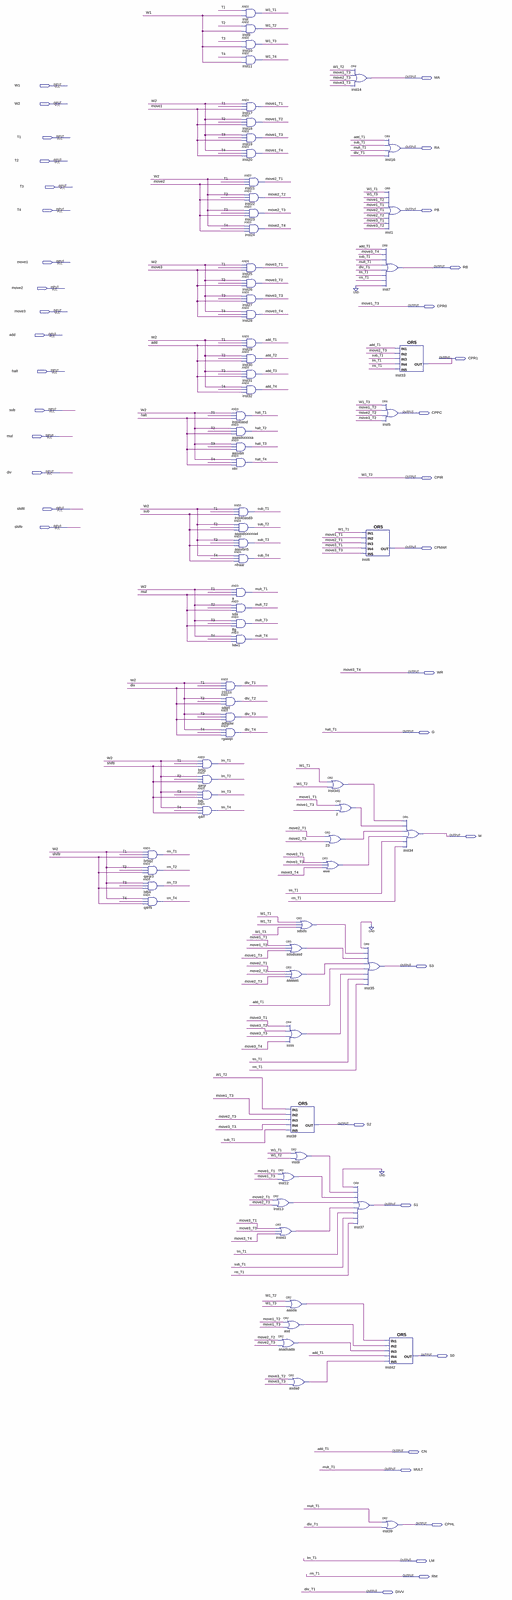
[diagram p0: schematic sheet, whole]
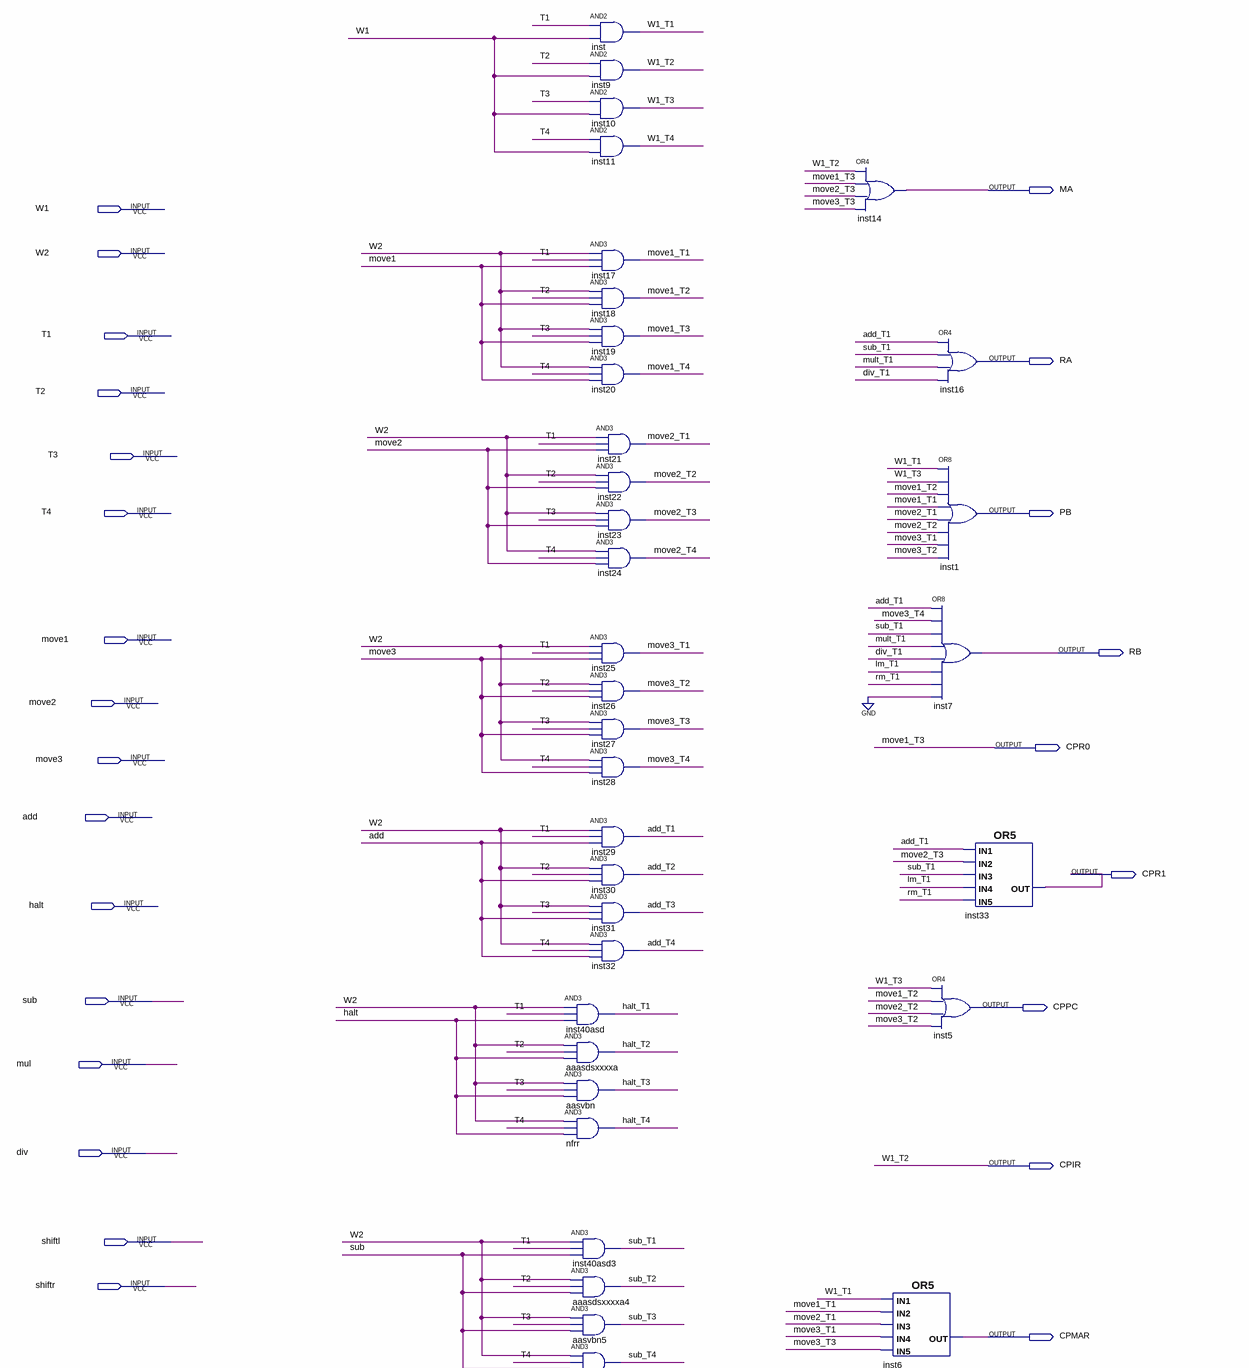
[diagram p1: schematic sheet, upper part]
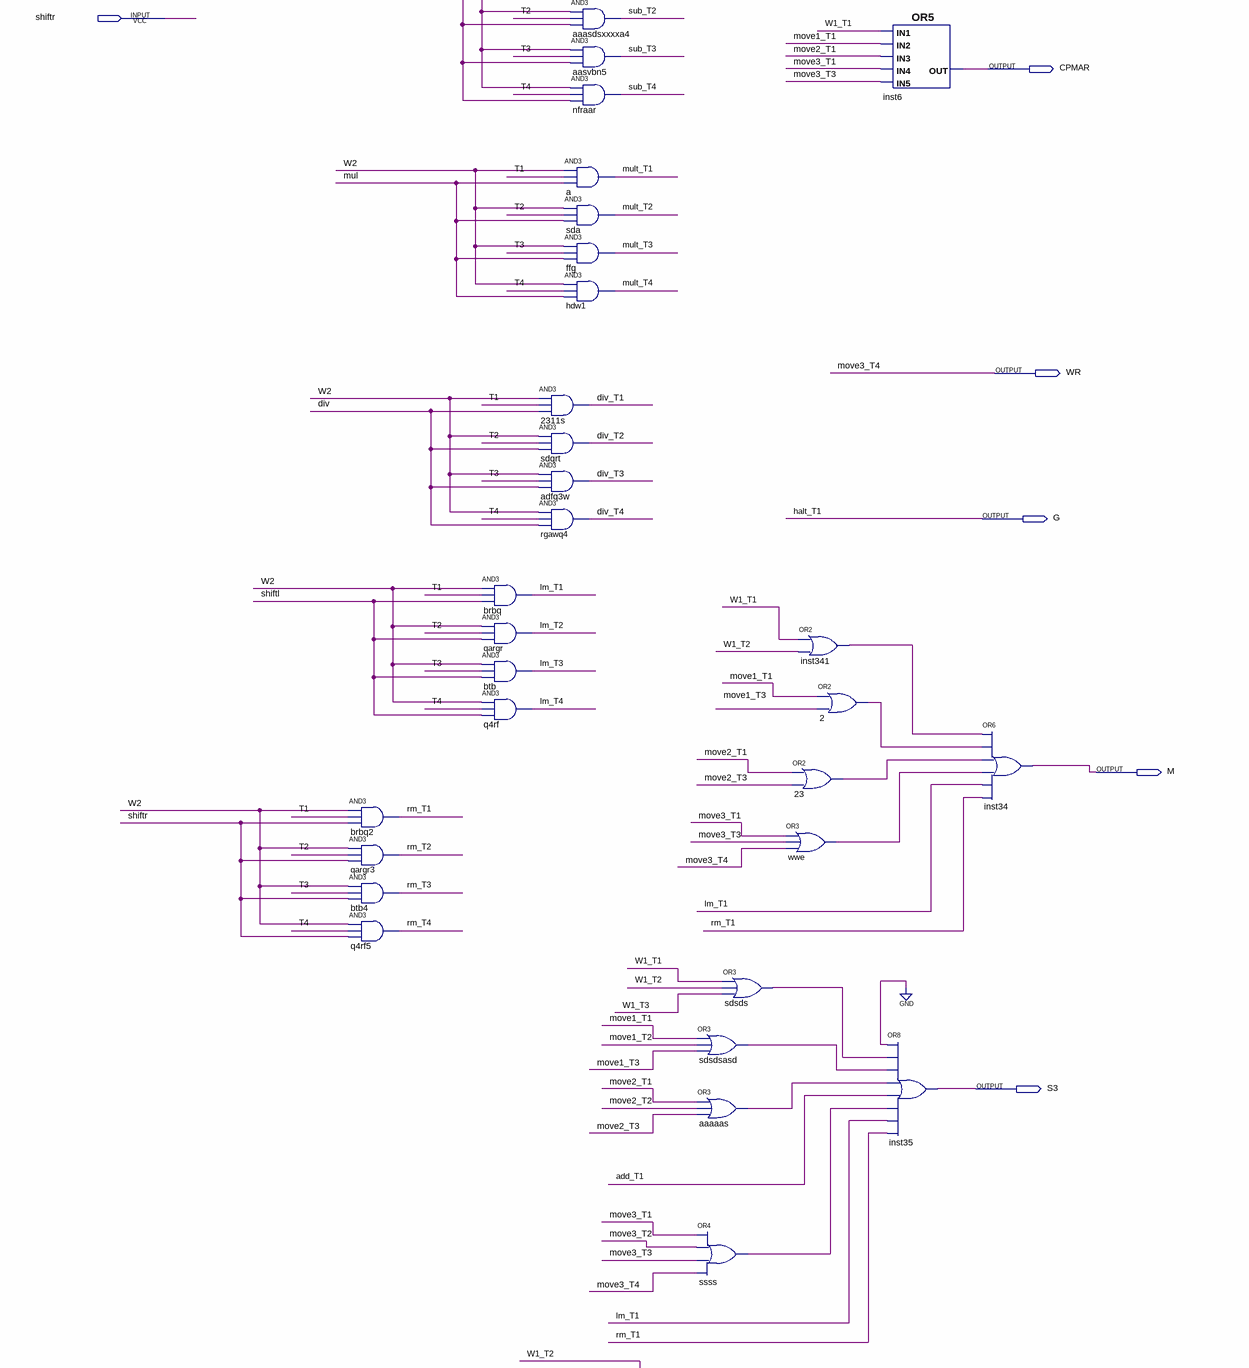
[diagram p2: schematic sheet, middle part]
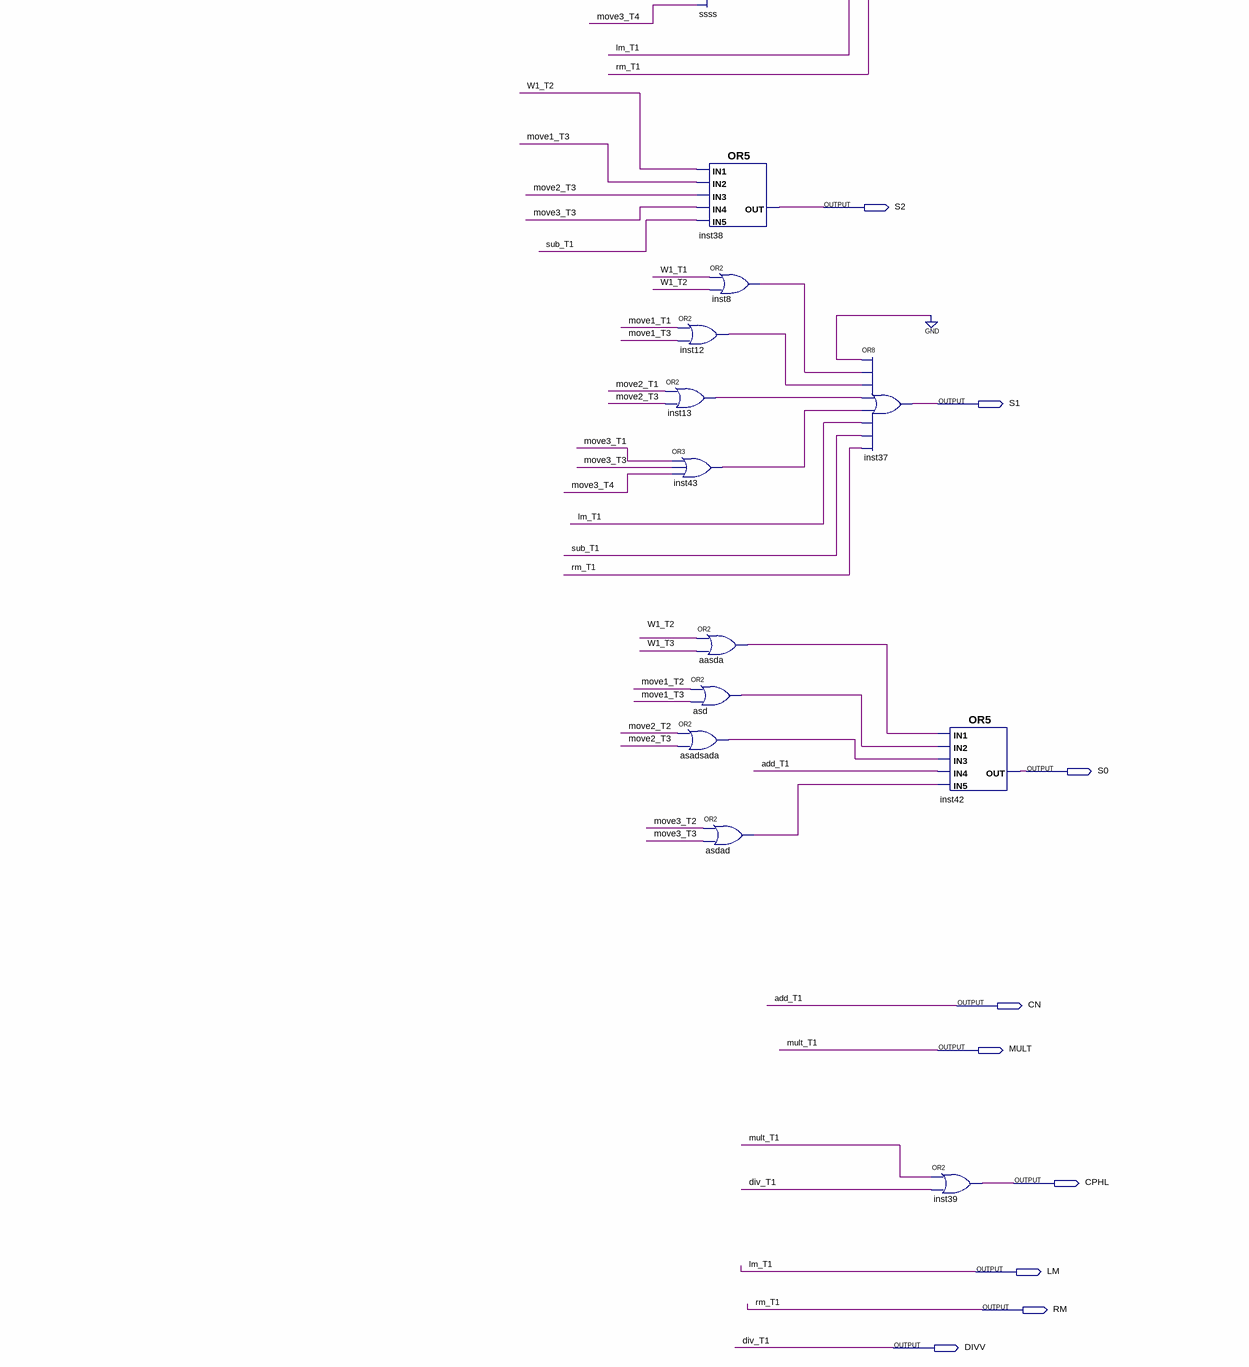
[diagram p3: schematic sheet, lower part]
// Quartus schematic Decoder.bdf as structural Verilog: 73 symbols, 38 pins
module Decoder (
  input  W1,
  input  W2,
  input  T1,
  input  T2,
  input  T3,
  input  T4,
  input  move1,
  input  move2,
  input  move3,
  input  add,
  input  halt,
  input  sub,
  input  mul,
  input  div,
  input  shiftl,
  input  shiftr,
  output MA,
  output RA,
  output PB,
  output RB,
  output CPR0,
  output CPR1,
  output CPPC,
  output CPIR,
  output CPMAR,
  output WR,
  output G,
  output M,
  output S3,
  output S2,
  output S1,
  output S0,
  output CN,
  output MULT,
  output CPHL,
  output LM,
  output RM,
  output DIVV
);

  wire aaaaas_out, aasda_out, add_T2, add_T3, add_T4, asadsada_out, asd_out, asdad_out, div_T2, div_T3,
       div_T4, halt_T2, halt_T3, halt_T4, inst8_out, inst12_out, inst13_out, inst43_out, inst341_out, lm_T2,
       lm_T3, lm_T4, move1_T1, move1_T2, move1_T4, move2_T1, move2_T2, move2_T3, move2_T4, move3_T1,
       move3_T2, move3_T3, mult_T2, mult_T3, mult_T4, n2_out, n23_out, rm_T2, rm_T3, rm_T4, sdsds_out,
       sdsdsasd_out, ssss_out, sub_T1, sub_T2, sub_T3, sub_T4, W1_T1, W1_T3, W1_T4, wwe_out;

  and brbq2 (RM, W2, T1, shiftr);
  and qargr3 (rm_T2, W2, T2, shiftr);
  and btb4 (rm_T3, W2, T3, shiftr);
  and q4rf5 (rm_T4, W2, T4, shiftr);
  and brbq (LM, W2, T1, shiftl);
  and qargr (lm_T2, W2, T2, shiftl);
  and btb (lm_T3, W2, T3, shiftl);
  and q4rf (lm_T4, W2, T4, shiftl);
  and u_2311s (DIVV, W2, T1, div);
  and sdqrt (div_T2, W2, T2, div);
  and adfq3w (div_T3, W2, T3, div);
  and rgawq4 (div_T4, W2, T4, div);
  and inst (W1_T1, T1, W1);
  and inst9 (CPIR, T2, W1);
  and inst10 (W1_T3, T3, W1);
  and inst11 (W1_T4, T4, W1);
  and inst17 (move1_T1, W2, T1, move1);
  and inst18 (move1_T2, W2, T2, move1);
  and inst19 (CPR0, W2, T3, move1);
  and inst20 (move1_T4, W2, T4, move1);
  and inst21 (move2_T1, W2, T1, move2);
  and inst22 (move2_T2, W2, T2, move2);
  and inst23 (move2_T3, W2, T3, move2);
  and inst24 (move2_T4, W2, T4, move2);
  and inst25 (move3_T1, W2, T1, move3);
  and inst26 (move3_T2, W2, T2, move3);
  and inst27 (move3_T3, W2, T3, move3);
  and inst28 (WR, W2, T4, move3);
  and inst29 (CN, W2, T1, add);
  and inst30 (add_T2, W2, T2, add);
  and inst31 (add_T3, W2, T3, add);
  and inst32 (add_T4, W2, T4, add);
  and inst40asd (G, W2, T1, halt);
  and aaasdsxxxxa (halt_T2, W2, T2, halt);
  and aasvbn (halt_T3, W2, T3, halt);
  and nfrr (halt_T4, W2, T4, halt);
  and inst40asd3 (sub_T1, W2, T1, sub);
  and aaasdsxxxxa4 (sub_T2, W2, T2, sub);
  and aasvbn5 (sub_T3, W2, T3, sub);
  and nfraar (sub_T4, W2, T4, sub);
  and a (MULT, W2, T1, mul);
  and sda (mult_T2, W2, T2, mul);
  and ffg (mult_T3, W2, T3, mul);
  and hdw1 (mult_T4, W2, T4, mul);
  or sdsdsasd (sdsdsasd_out, move1_T1, move1_T2, CPR0);
  or aaaaas (aaaaas_out, move2_T1, move2_T2, move2_T3);
  or ssss (ssss_out, move3_T1, move3_T2, move3_T3, WR);
  or inst38 (S2, CPIR, CPR0, move2_T3, move3_T3, sub_T1);
  or inst12 (inst12_out, move1_T1, CPR0);
  or inst13 (inst13_out, move2_T1, move2_T3);
  or inst43 (inst43_out, move3_T1, move3_T3, WR);
  or aasda (aasda_out, CPIR, W1_T3);
  or asd (asd_out, move1_T2, CPR0);
  or asadsada (asadsada_out, move2_T2, move2_T3);
  or sdsds (sdsds_out, W1_T1, CPIR, W1_T3);
  or inst8 (inst8_out, W1_T1, CPIR);
  or asdad (asdad_out, move3_T2, move3_T3);
  or inst341 (inst341_out, W1_T1, CPIR);
  or u_23 (n23_out, move2_T1, move2_T3);
  or wwe (wwe_out, move3_T1, move3_T3, WR);
  or u_2 (n2_out, move1_T1, CPR0);
  or inst14 (MA, CPIR, CPR0, move2_T3, move3_T3);
  or inst6 (CPMAR, W1_T1, move1_T1, move2_T1, move3_T1, move3_T3);
  or inst35 (S3, 1'b0, sdsds_out, sdsdsasd_out, aaaaas_out, CN, ssss_out, LM, RM);
  or inst37 (S1, 1'b0, inst8_out, inst12_out, inst13_out, inst43_out, LM, sub_T1, RM);
  or inst16 (RA, CN, sub_T1, MULT, DIVV);
  or inst1 (PB, W1_T1, W1_T3, move1_T2, move1_T1, move2_T1, move2_T2, move3_T1, move3_T2);
  or inst7 (RB, CN, WR, sub_T1, MULT, DIVV, LM, RM, 1'b0);
  or inst5 (CPPC, W1_T3, move1_T2, move2_T2, move3_T2);
  or inst42 (S0, aasda_out, asd_out, asadsada_out, CN, asdad_out);
  or inst39 (CPHL, MULT, DIVV);
  or inst33 (CPR1, CN, move2_T3, sub_T1, LM, RM);
  or inst34 (M, inst341_out, n2_out, n23_out, wwe_out, LM, RM);

  // Other names for the same wires on the sheet: add_T1 = CN; div_T1 = DIVV; halt_T1 = G; lm_T1 = LM; move1_T3 = CPR0;
  //   move3_T4 = WR; mult_T1 = MULT; rm_T1 = RM; W1_T2 = CPIR
endmodule
